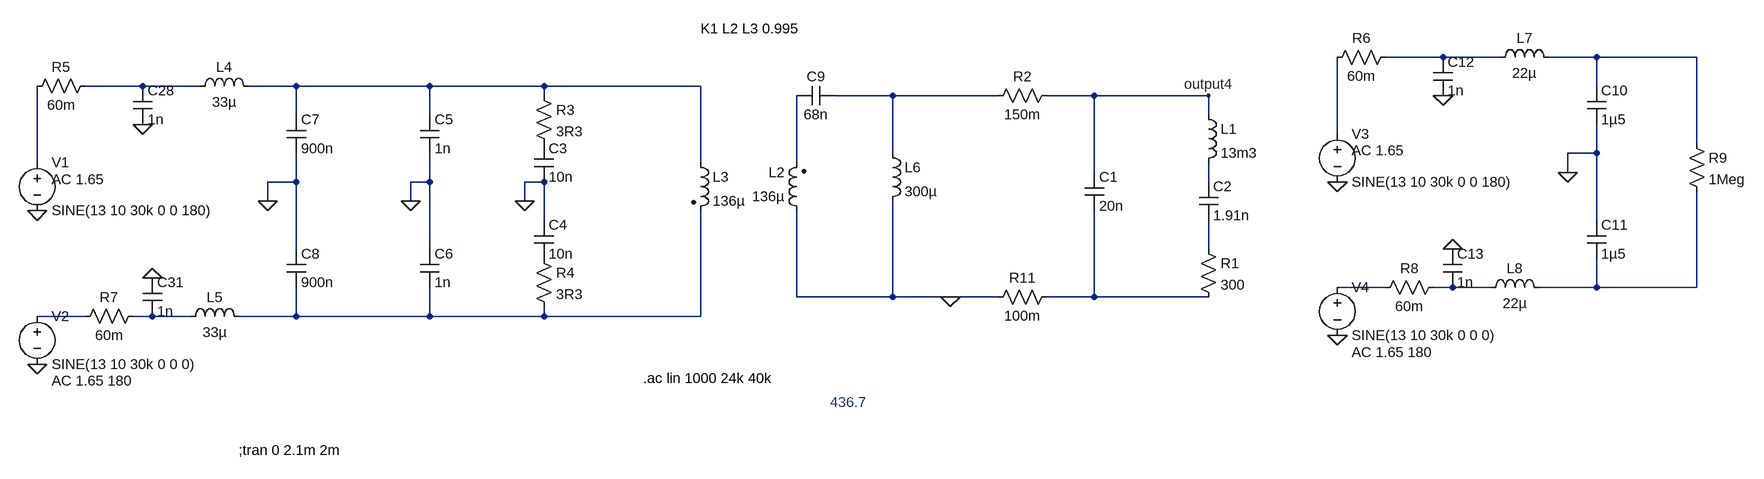
[diagram p0: schematic Impedance_Matching.asc]
Impedance_Matching.asc, the LTspice schematic file:
Version 4
SHEET 1 4832 884
WIRE 2528 -432 2432 -432
WIRE 2624 -432 2528 -432
WIRE 2784 -432 2704 -432
WIRE 3056 -432 2784 -432
WIRE -224 -384 -320 -384
WIRE -128 -384 -224 -384
WIRE 32 -384 -48 -384
WIRE 256 -384 32 -384
WIRE 448 -384 256 -384
WIRE 736 -384 448 -384
WIRE 2784 -384 2784 -432
WIRE 448 -368 448 -384
WIRE 1056 -368 960 -368
WIRE 1232 -368 1056 -368
WIRE 1392 -368 1312 -368
WIRE 1584 -368 1392 -368
WIRE 32 -336 32 -384
WIRE 256 -336 256 -384
WIRE 1584 -336 1584 -368
WIRE 2352 -304 2352 -432
WIRE 3056 -288 3056 -432
WIRE 1056 -272 1056 -368
WIRE 2784 -272 2784 -320
WIRE 2784 -272 2736 -272
WIRE -400 -256 -400 -384
WIRE 736 -256 736 -384
WIRE 896 -256 896 -368
WIRE 1392 -240 1392 -368
WIRE 2736 -240 2736 -272
WIRE 32 -224 32 -272
WIRE 32 -224 -16 -224
WIRE 256 -224 256 -272
WIRE 256 -224 224 -224
WIRE 448 -224 416 -224
WIRE 1584 -224 1584 -256
WIRE -16 -192 -16 -224
WIRE 224 -192 224 -224
WIRE 416 -192 416 -224
WIRE 448 -160 448 -224
WIRE 2784 -160 2784 -272
WIRE 32 -112 32 -224
WIRE 256 -112 256 -224
WIRE 1584 -112 1584 -160
WIRE 2432 -48 2352 -48
WIRE 2544 -48 2512 -48
WIRE 2608 -48 2544 -48
WIRE 2784 -48 2784 -96
WIRE 2784 -48 2688 -48
WIRE 3056 -48 3056 -208
WIRE 3056 -48 2784 -48
WIRE 896 -32 896 -176
WIRE 1056 -32 1056 -192
WIRE 1056 -32 896 -32
WIRE 1152 -32 1056 -32
WIRE 1232 -32 1152 -32
WIRE 1392 -32 1392 -176
WIRE 1392 -32 1312 -32
WIRE 1584 -32 1392 -32
WIRE -320 0 -400 0
WIRE -208 0 -240 0
WIRE -144 0 -208 0
WIRE 32 0 32 -48
WIRE 32 0 -64 0
WIRE 256 0 256 -48
WIRE 256 0 32 0
WIRE 448 0 448 -16
WIRE 448 0 256 0
WIRE 736 0 736 -176
WIRE 736 0 448 0
FLAG 1584 -368 output4
FLAG -16 -192 0
FLAG 224 -192 0
FLAG 416 -192 0
FLAG -400 -176 0
FLAG -400 80 0
FLAG 1152 -32 0
FLAG -224 -320 0
FLAG -208 -64 0
FLAG 2736 -240 0
FLAG 2352 -224 0
FLAG 2352 32 0
FLAG 2528 -368 0
FLAG 2544 -112 0
SYMBOL cap 1376 -240 R0
SYMATTR InstName C1
SYMATTR Value 20n
SYMBOL cap 1568 -224 R0
SYMATTR InstName C2
SYMATTR Value 1.91n
SYMBOL ind 1568 -352 R0
SYMATTR InstName L1
SYMATTR Value 13m3
SYMBOL res 1568 -128 R0
SYMATTR InstName R1
SYMATTR Value 300
SYMBOL ind2 912 -160 R180
WINDOW 0 36 80 Left 2
WINDOW 3 36 40 Left 2
SYMATTR InstName L2
SYMATTR Value 136µ
SYMATTR Type ind
SYMATTR SpiceLine Rser=480m
SYMBOL ind2 720 -272 R0
SYMATTR InstName L3
SYMATTR Value 136µ
SYMATTR Type ind
SYMATTR SpiceLine Rser=325m
SYMBOL res 432 -384 R0
SYMATTR InstName R3
SYMATTR Value 3R3
SYMBOL res 432 -112 R0
SYMATTR InstName R4
SYMATTR Value 3R3
SYMBOL cap 432 -288 R0
SYMATTR InstName C3
SYMATTR Value 10n
SYMBOL cap 432 -160 R0
SYMATTR InstName C4
SYMATTR Value 10n
SYMBOL cap 240 -336 R0
SYMATTR InstName C5
SYMATTR Value 1n
SYMBOL cap 240 -112 R0
SYMATTR InstName C6
SYMATTR Value 1n
SYMBOL cap 16 -336 R0
SYMATTR InstName C7
SYMATTR Value 900n
SYMATTR SpiceLine Rser=10m
SYMBOL cap 16 -112 R0
SYMATTR InstName C8
SYMATTR Value 900n
SYMATTR SpiceLine Rser=10m
SYMBOL ind -144 -368 R270
WINDOW 0 32 56 VTop 2
WINDOW 3 5 56 VBottom 2
SYMATTR InstName L4
SYMATTR Value 33µ
SYMATTR SpiceLine Rser=140m
SYMBOL res -304 -400 R90
WINDOW 0 0 56 VBottom 2
WINDOW 3 32 56 VTop 2
SYMATTR InstName R5
SYMATTR Value 60m
SYMBOL voltage -400 -272 R0
WINDOW 123 24 44 Left 2
WINDOW 39 0 0 Left 0
SYMATTR Value2 AC 1.65
SYMATTR InstName V1
SYMATTR Value SINE(13 10 30k 0 0 180)
SYMBOL voltage -400 -16 R0
WINDOW 123 24 124 Left 2
WINDOW 39 0 0 Left 0
SYMATTR Value2 AC 1.65 180
SYMATTR InstName V2
SYMATTR Value SINE(13 10 30k 0 0 0)
SYMBOL res -224 -16 R90
WINDOW 0 0 56 VBottom 2
WINDOW 3 32 56 VTop 2
SYMATTR InstName R7
SYMATTR Value 60m
SYMBOL res 1328 -384 R90
WINDOW 0 0 56 VBottom 2
WINDOW 3 32 56 VTop 2
SYMATTR InstName R2
SYMATTR Value 150m
SYMBOL res 1328 -48 R90
WINDOW 0 0 56 VBottom 2
WINDOW 3 32 56 VTop 2
SYMATTR InstName R11
SYMATTR Value 100m
SYMBOL cap -240 -384 R0
SYMATTR InstName C28
SYMATTR Value 1n
SYMBOL cap -224 -64 R0
SYMATTR InstName C31
SYMATTR Value 1n
SYMBOL ind -160 16 R270
WINDOW 0 32 56 VTop 2
WINDOW 3 5 56 VBottom 2
SYMATTR InstName L5
SYMATTR Value 33µ
SYMATTR SpiceLine Rser=140m
SYMBOL cap 960 -384 R90
WINDOW 0 0 32 VBottom 2
WINDOW 3 32 32 VTop 2
SYMATTR InstName C9
SYMATTR Value 68n
SYMATTR SpiceLine Rser=10m
SYMBOL ind 1040 -288 R0
SYMATTR InstName L6
SYMATTR Value 300µ
SYMATTR SpiceLine Rser=400m
SYMBOL cap 2768 -384 R0
SYMATTR InstName C10
SYMATTR Value 1µ5
SYMATTR SpiceLine Rser=10m
SYMBOL cap 2768 -160 R0
SYMATTR InstName C11
SYMATTR Value 1µ5
SYMATTR SpiceLine Rser=10m
SYMBOL ind 2608 -416 R270
WINDOW 0 32 56 VTop 2
WINDOW 3 5 56 VBottom 2
SYMATTR InstName L7
SYMATTR Value 22µ
SYMATTR SpiceLine Rser=140m
SYMBOL res 2448 -448 R90
WINDOW 0 0 56 VBottom 2
WINDOW 3 32 56 VTop 2
SYMATTR InstName R6
SYMATTR Value 60m
SYMBOL voltage 2352 -320 R0
WINDOW 123 24 44 Left 2
WINDOW 39 0 0 Left 0
SYMATTR Value2 AC 1.65
SYMATTR InstName V3
SYMATTR Value SINE(13 10 30k 0 0 180)
SYMBOL voltage 2352 -64 R0
WINDOW 123 24 124 Left 2
WINDOW 39 0 0 Left 0
SYMATTR Value2 AC 1.65 180
SYMATTR InstName V4
SYMATTR Value SINE(13 10 30k 0 0 0)
SYMBOL res 2528 -64 R90
WINDOW 0 0 56 VBottom 2
WINDOW 3 32 56 VTop 2
SYMATTR InstName R8
SYMATTR Value 60m
SYMBOL cap 2512 -432 R0
SYMATTR InstName C12
SYMATTR Value 1n
SYMBOL cap 2528 -112 R0
SYMATTR InstName C13
SYMATTR Value 1n
SYMBOL ind 2592 -32 R270
WINDOW 0 32 56 VTop 2
WINDOW 3 5 56 VBottom 2
SYMATTR InstName L8
SYMATTR Value 22µ
SYMATTR SpiceLine Rser=140m
SYMBOL res 3040 -304 R0
SYMATTR InstName R9
SYMATTR Value 1Meg
TEXT 736 -480 Left 2 !K1 L2 L3 0.995
TEXT -64 224 Left 2 !;tran 0 2.1m 2m
TEXT 640 104 Left 2 !.ac lin 1000 24k 40k
TEXT 952 144 Left 2 ;436.7

The netlist it stands for:
* Impedance_Matching.asc
C1 output4 N014 20n
C2 N009 N010 1.91n
L1 output4 N009 13m3
R1 N010 N014 300
L2 0 N008 136µ Rser=480m
L3 N004 N017 136µ Rser=325m
R3 N004 P001 3R3
R4 P002 N017 3R3
C3 P001 0 10n
C4 0 P002 10n
C5 N004 0 1n
C6 0 N017 1n
C7 N004 0 900n Rser=10m
C8 0 N017 900n Rser=10m
L4 N003 N004 33µ Rser=140m
R5 N003 N007 60m
V1 N007 0 SINE(13 10 30k 0 0 180) AC 1.65
V2 N015 0 SINE(13 10 30k 0 0 0) AC 1.65 180
R7 N016 N015 60m
R2 output4 N005 150m
R11 N014 0 100m
C28 N003 0 1n
C31 0 N016 1n
L5 N016 N017 33µ Rser=140m
C9 N005 N008 68n Rser=10m
L6 N005 0 300µ Rser=400m
C10 N002 0 1µ5 Rser=10m
C11 0 N013 1µ5 Rser=10m
L7 N001 N002 22µ Rser=140m
R6 N001 N006 60m
V3 N006 0 SINE(13 10 30k 0 0 180) AC 1.65
V4 N011 0 SINE(13 10 30k 0 0 0) AC 1.65 180
R8 N012 N011 60m
C12 N001 0 1n
C13 0 N012 1n
L8 N012 N013 22µ Rser=140m
R9 N002 N013 1Meg
K1 L2 L3 0.995
;tran 0 2.1m 2m
.ac lin 1000 24k 40k
* 436.7
.backanno
.end